# Altium schematic sheet top.SchDoc
size A4; DocumentNumber: 1; SheetNumber: 1
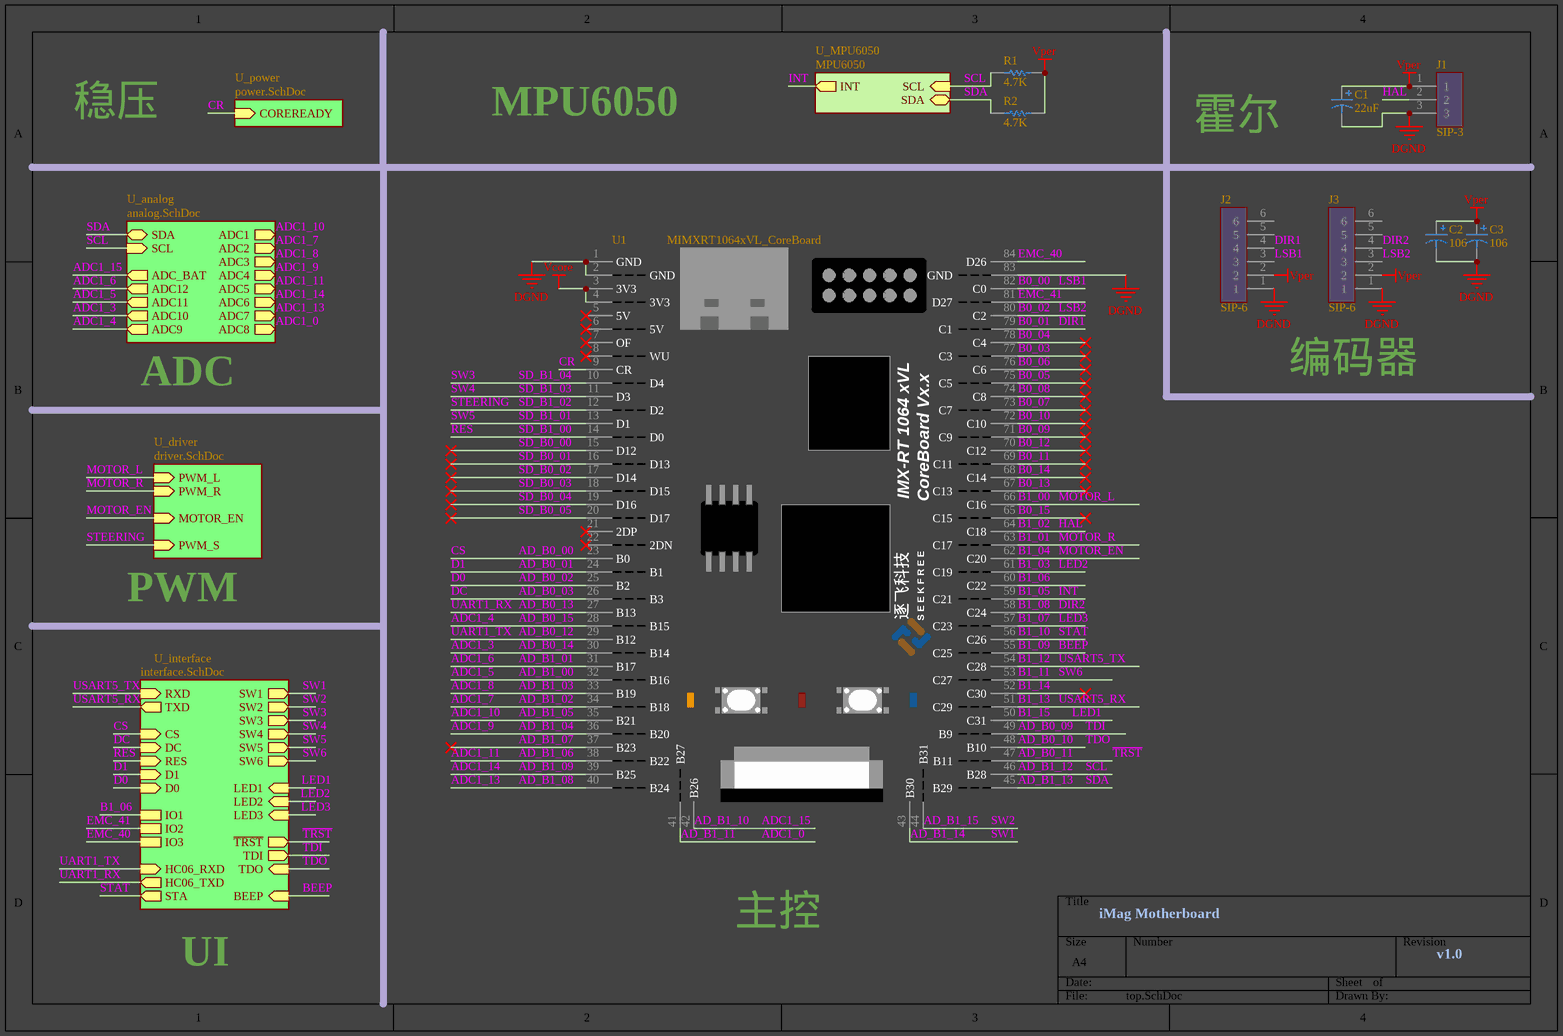
[diagram p0: top.SchDoc]

## Parts
C1  22uF  [贴片电解 4*5.4]
C2  106  [3216-ce]
C3  106  [3216-ce]
J1  SIP-3  [XH2.54-3SMD]
J2  SIP-6  [2.54简易牛角座6P]
J3  SIP-6  [2.54简易牛角座6P]
R1  4.7K  [R0402]
R2  4.7K  [R0402]
U1  MIMXRT1064xVL_CoreBoard  [MIMXRT1064xVL_CoreBoard]

## Sub-sheets
U_analog = analog.SchDoc: ADC1 (out), ADC2 (out), ADC3 (out), ADC4 (out), ADC5 (out), ADC6 (out), ADC7 (out), ADC8 (out), ADC_BAT (out), ADC11 (out), ADC9 (out), ADC12 (out), ADC10 (out), SCL (in), SDA (bidir)
U_driver = driver.SchDoc: PWM_L (in), PWM_R (in), PWM_S (in), MOTOR_EN (in)
U_interface = interface.SchDoc: SW1 (out), SW2 (out), SW3 (out), SW4 (out), SW5 (out), SW6 (out), TXD (out), RXD (in), LED1 (in), LED2 (in), LED3 (in), CS (in), DC (in), RES (in), D1 (in), D0 (in), IO2, IO1, IO3, STA (out), HC06_RXD (in), HC06_TXD (out), ~{TRST} (out), TDI (out), TDO (in), BEEP (in)
U_MPU6050 = MPU6050: SCL (in), SDA (bidir), INT (out)
U_power = power.SchDoc: COREREADY (in)

## Nets
DGND: C1.2 C2.2 C3.2 J1.3 J2.1 J3.1 U1.1(GND) U1.2(GND) U1.83(GND)
Vcore: U1.3(3V3) U1.4(3V3)
Vper: C1.1 C2.1 C3.1 J1.1 J2.2 J3.2 R1.1 R2.1
~{TRST}: U1.47(B11) ; sheet U_interface/~{TRST}  [also labelled AD_B0_11]
AD_B0_00: U1.23(B0) ; sheet U_interface/CS  [also labelled CS]
AD_B0_01: U1.24(B1) ; sheet U_interface/D1  [also labelled D1]
AD_B0_02: U1.25(B2) ; sheet U_interface/D0  [also labelled D0]
AD_B0_03: U1.26(B3) ; sheet U_interface/DC  [also labelled DC]
AD_B0_09: U1.49(B9) ; sheet U_interface/TDI  [also labelled TDI]
AD_B0_10: U1.48(B10) ; sheet U_interface/TDO  [also labelled TDO]
AD_B0_12: U1.29(B12) ; sheet U_interface/HC06_RXD  [also labelled UART1_TX]
AD_B0_13: U1.27(B13) ; sheet U_interface/HC06_TXD  [also labelled UART1_RX]
AD_B0_14: U1.30(B14) ; sheet U_analog/ADC10  [also labelled ADC1_3]
AD_B0_15: U1.28(B15) ; sheet U_analog/ADC9  [also labelled ADC1_4]
AD_B1_00: U1.32(B16) ; sheet U_analog/ADC11  [also labelled ADC1_5]
AD_B1_01: U1.31(B17) ; sheet U_analog/ADC12  [also labelled ADC1_6]
AD_B1_02: U1.34(B18) ; sheet U_analog/ADC2  [also labelled ADC1_7]
AD_B1_03: U1.33(B19) ; sheet U_analog/ADC3  [also labelled ADC1_8]
AD_B1_04: U1.36(B20) ; sheet U_analog/ADC4  [also labelled ADC1_9]
AD_B1_05: U1.35(B21) ; sheet U_analog/ADC1  [also labelled ADC1_10]
AD_B1_06: U1.38(B22) ; sheet U_analog/ADC5  [also labelled ADC1_11]
AD_B1_07: U1.37(B23)
AD_B1_08: U1.40(B24) ; sheet U_analog/ADC7  [also labelled ADC1_13]
AD_B1_09: U1.39(B25) ; sheet U_analog/ADC6  [also labelled ADC1_14]
AD_B1_10: U1.42(B26) ; sheet U_analog/ADC_BAT  [also labelled ADC1_15]
AD_B1_11: U1.41(B27) ; sheet U_analog/ADC8  [also labelled ADC1_0]
AD_B1_12: R1.2 U1.46(B28) ; sheet U_analog/SCL, sheet U_MPU6050/SCL  [also labelled SCL]
AD_B1_13: R2.2 U1.45(B29) ; sheet U_analog/SDA, sheet U_MPU6050/SDA  [also labelled SDA]
AD_B1_14: U1.43(B30) ; sheet U_interface/SW1  [also labelled SW1]
AD_B1_15: U1.44(B31) ; sheet U_interface/SW2  [also labelled SW2]
B0_00: J2.3 U1.82(C0)  [also labelled LSB1]
B0_01: J2.4 U1.79(C1)  [also labelled DIR1]
B0_02: J3.3 U1.80(C2)  [also labelled LSB2]
B0_03: U1.77(C3)
B0_04: U1.78(C4)
B0_05: U1.75(C5)
B0_06: U1.76(C6)
B0_07: U1.73(C7)
B0_08: U1.74(C8)
B0_09: U1.71(C9)
B0_10: U1.72(C10)
B0_11: U1.69(C11)
B0_12: U1.70(C12)
B0_13: U1.67(C13)
B0_14: U1.68(C14)
B0_15: U1.65(C15)
B1_00: U1.66(C16) ; sheet U_driver/PWM_L  [also labelled MOTOR_L]
B1_01: U1.63(C17) ; sheet U_driver/PWM_R  [also labelled MOTOR_R]
B1_02: J1.2 U1.64(C18)  [also labelled HAL]
B1_03: U1.61(C19) ; sheet U_interface/LED2  [also labelled LED2]
B1_04: U1.62(C20) ; sheet U_driver/MOTOR_EN  [also labelled MOTOR_EN]
B1_05: U1.59(C21) ; sheet U_MPU6050/INT  [also labelled INT]
B1_06: U1.60(C22) ; sheet U_interface/IO1
B1_07: U1.57(C23) ; sheet U_interface/LED3  [also labelled LED3]
B1_08: J3.4 U1.58(C24)  [also labelled DIR2]
B1_09: U1.55(C25) ; sheet U_interface/BEEP  [also labelled BEEP]
B1_10: U1.56(C26) ; sheet U_interface/STA  [also labelled STAT]
B1_11: U1.53(C27) ; sheet U_interface/SW6  [also labelled SW6]
B1_12: U1.54(C28) ; sheet U_interface/RXD  [also labelled USART5_TX]
B1_13: U1.51(C29) ; sheet U_interface/TXD  [also labelled USART5_RX]
B1_14: U1.52(C30)
B1_15: U1.50(C31) ; sheet U_interface/LED1  [also labelled LED1]
CR: U1.9(CR) ; sheet U_power/COREREADY
EMC_40: U1.84(D26) ; sheet U_interface/IO3
EMC_41: U1.81(D27) ; sheet U_interface/IO2
RES: U1.14(D0) ; sheet U_interface/RES  [also labelled SD_B1_00]
SD_B0_00: U1.15(D12)
SD_B0_01: U1.16(D13)
SD_B0_02: U1.17(D14)
SD_B0_03: U1.18(D15)
SD_B0_04: U1.19(D16)
SD_B0_05: U1.20(D17)
SD_B1_01: U1.13(D1) ; sheet U_interface/SW5  [also labelled SW5]
SD_B1_02: U1.12(D2) ; sheet U_driver/PWM_S  [also labelled STEERING]
SD_B1_03: U1.11(D3) ; sheet U_interface/SW4  [also labelled SW4]
SD_B1_04: U1.10(D4) ; sheet U_interface/SW3  [also labelled SW3]

Not connected (* = marked no-connect by the designer): J2 5 6; J3 5 6; U1 5(5V)* 6(5V)* 7(OF)* 8(WU)* 21(2DP)* 22(2DN)*

## Notes on the sheet
- 稳压
- MPU6050
- 霍尔
- 编码器
- ADC
- PWM
- iMag Motherboard
- UI
- 主控
- v1.0
- Title
- Size:
- Date:
- A4
- Number:
- Time:
- Revision:
- Sheet
- of
- File:
- (in symbol MIMXRT1064xVL_CoreBoard) IMX-RT 1064 xVL; CoreBoard Vx.x; 逐飞科技; S E E K F R E E

## Library data of the parts
C1-C3 = 电解电容: Polarized Capacitor (Axial); Value: 100pF; Published: 8-Jun-2000; LatestRevisionDate: 17-Jul-2002; LatestRevisionNote: Re-released for DXP Platform.; PackageReference: POLAR0.8; Publisher: Altium Limited; PackageDescription: Polarized Capacitor; 2 Leads
R1 R2 = 电阻: Resistor; Value: 150R; Published: 8-Jun-2000; LatestRevisionDate: 17-Jul-2002; LatestRevisionNote: Re-released for DXP Platform.; PackageReference: AXIAL-0.3; Publisher: Altium Limited; PackageDescription: Axial Device, Thru-Hole; 2 Leads; 0.3 in Pin Spacing
U1 = MIMXRT1064xVL_CoreBoard: 逐飞科技i.MX RT1064核心板整体原理，可直接使用